# Altium schematic sheet Sheet1.SchDoc
size A; SheetNumber: 1; SheetTotal: 1
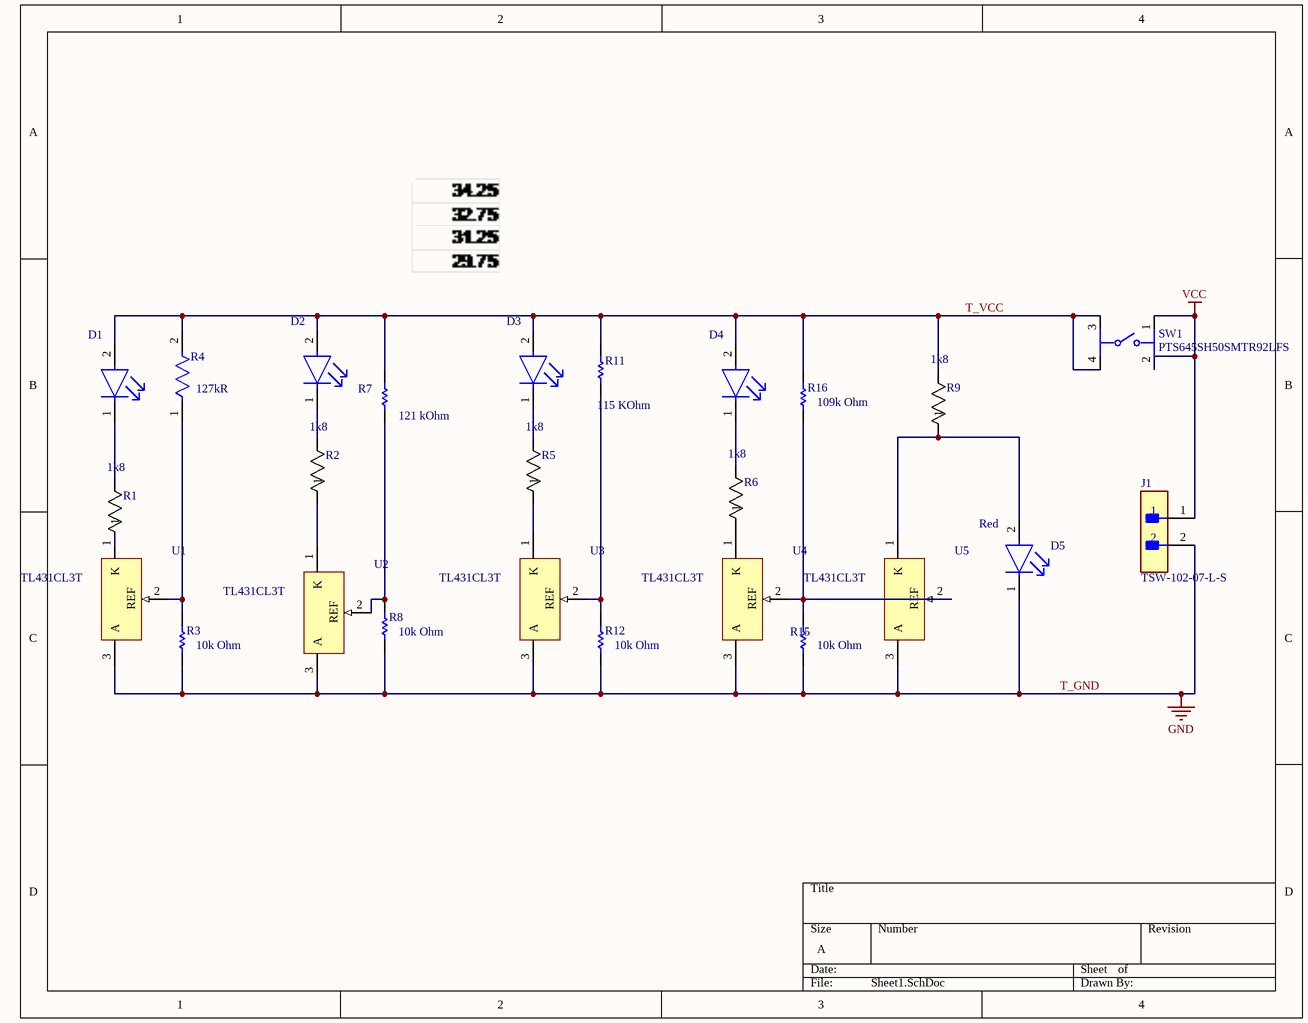
[diagram p0: Sheet1.SchDoc]

## Parts
D1  LTST-C193KGKT-5A  [FP-LTST-C193KGKT-5A-MFG]  (value not drawn)
D2  LTST-C193KGKT-5A  [FP-LTST-C193KGKT-5A-MFG]  (value not drawn)
D3  LTST-C193KGKT-5A  [FP-LTST-C193KGKT-5A-MFG]  (value not drawn)
D4  LTST-C193KGKT-5A  [FP-LTST-C193KGKT-5A-MFG]  (value not drawn)
D5  Illumination Color: Red  [FP-LTST-C193KRKT-5A-MFG]  (hidden comment: LTST-C193KRKT-5A)
J1  TSW-102-07-L-S  [FP-TSW-102-07-L-S-MFG]
R1  Resistance: 1k8  [RES_RMCF2512_STP]  (hidden comment: RMCF2512JT1K80)
R2  Resistance: 1k8  [RES_RMCF2512_STP]  (hidden comment: RMCF2512JT1K80)
R3  value 10k Ohm  [RESC1609X50X30NL8T20]  (hidden comment: CRCW060310K0FKEA)
R4  Resistance: 127kR  [FP-CRCW0603-e3-IPC_A]  (hidden comment: CRCW0603127KFKEA)
R5  Resistance: 1k8  [RES_RMCF2512_STP]  (hidden comment: RMCF2512JT1K80)
R6  Resistance: 1k8  [RES_RMCF2512_STP]  (hidden comment: RMCF2512JT1K80)
R7  value 121 kOhm  [RESC1608X55X25ML10T15]  (hidden comment: RC0603FR-07121KL)
R8  value 10k Ohm  [RESC1609X50X30NL8T20]  (hidden comment: CRCW060310K0FKEA)
R9  Resistance: 1k8  [RES_RMCF2512_STP]  (hidden comment: RMCF2512JT1K80)
R11  value 115 KOhm  [RESC1608X55X30ML15T15]  (hidden comment: ERJ-3EKF1153V)
R12  value 10k Ohm  [RESC1609X50X30NL8T20]  (hidden comment: CRCW060310K0FKEA)
R15  value 10k Ohm  [RESC1609X50X30NL8T20]  (hidden comment: CRCW060310K0FKEA)
R16  value 109k Ohm  [RESC2013X60X35NL10T20]  (hidden comment: RC0805FR-109K09L)
SW1  PTS645SH50SMTR92LFS  [FP-PTS645SH50SMTR92LFS-MFG]
U1  TL431CL3T  [SOT23-3_M]
U2  TL431CL3T  [SOT23-3_M]
U3  TL431CL3T  [SOT23-3_M]
U4  TL431CL3T  [SOT23-3_M]
U5  TL431CL3T  [SOT23-3_M]

## Nets
T_GND: D5.1(C) J1.2 R3.1 R8.1 R12.1 R15.1 U1.3(A) U2.3(A) U3.3(A) U4.3(A) U5.3(A)  [also labelled GND]
VCC: J1.1 SW1.1 SW1.2
T_VCC: D1.2(A) D2.2(A) D3.2(A) D4.2(A) R4.2 R7.2 R9.2 R11.2 R16.2 SW1.3 SW1.4
NetD1_1: D1.1(C) R1.2
NetD2_1: D2.1(C) R2.2
NetD3_1: D3.1(C) R5.2
NetD4_1: D4.1(C) R6.2
NetD5_2: D5.2(A) R9.1 U5.1(K)
NetR1_1: R1.1 U1.1(K)
NetR2_1: R2.1 U2.1(K)
NetR3_2: R3.2 R4.1 U1.2(REF)
NetR5_1: R5.1 U3.1(K)
NetR6_1: R6.1 U4.1(K)
NetR7_1: R7.1 R8.2 U2.2(REF)
NetR11_1: R11.1 R12.2 U3.2(REF)
NetR15_2: R15.2 R16.1 U4.2(REF) U5.2(REF)

## Library data of the parts
D1-D4 = CMP-2000-06622-2: LED GREEN CLEAR CHIP SMD; Forward Current: 30mA; Power Dissipation: 75mW; Luminous Intensity: 28mcd; Lens Style: Diffused; Lens Color: Colorless; Forward Voltage: 2.3V; Test Current: 5mA; Viewing Angle: 130°; Reverse Voltage: 5V; Dominant Wavelength: 576.5nm; Number of Elements: 1; Number of Pins: 2; Case/Package: 0603; Width: 0.8mm; Radiation Hardening: No; Lead Free: Lead Free; Lens Transparency: Clear; Max Operating Temperature: 85°C; Illumination Color: Green; Color: Green; Packaging: Tape and Reel; Depth: 0.8mm; Length: 1.6mm; Mount: Surface Mount; Case Code (Imperial): 0603; Height: 0.35mm; Min Operating Temperature: -55°C; Package Quantity: 3000; Case Code (Metric): 1608; Power Rating: 75mW; Number of LEDs: 1
D5 = CMP-2000-06623-2: LED RED CLEAR CHIP SMD; Power Dissipation: 50mW; Lens Style: Diffused; Test Current: 5mA; Dominant Wavelength: 631nm; Reverse Voltage: 5V; Number of Elements: 1; Viewing Angle: 130°; Luminous Intensity: 45mcd; Lens Color: Colorless; Forward Voltage: 2.3V; Case Code (Imperial): 0603; Lead Free: Lead Free; Radiation Hardening: No; Width: 0.8mm; Number of Pins: 2; Packaging: Tape and Reel; Depth: 0.8mm; Height: 0.35mm; Mount: Surface Mount; Case Code (Metric): 1608; Forward Current: 5mA; Lens Transparency: Clear; Case/Package: 0603; Length: 1.6mm; Color: Red; Max Operating Temperature: 85°C; Number of LEDs: 1; Min Operating Temperature: -55°C; Package Quantity: 3000
J1 = CMP-02766-001428-1: CONN HEADER VERT 2POS 2.54MM; Voltage Rating: 550V; Current Rating: 7.6A; Gender: Male; Number of Contacts: 2; Connector Type: Male Pin; Radiation Hardening: No; Orientation: Straight; Contact Plating: Gold; Max Operating Temperature: 125°C; Mount: Through Hole; Package Quantity: 1; Number of Rows: 1; Housing Material: Polyester; RoHS Compliant: Yes; Length: 5.08mm; Max Voltage Rating (AC): 550V; Pitch: 2.54mm; Packaging: Bulk; Depth: 2.54mm; Termination: Solder; Min Operating Temperature: -55°C; Housing Color: Black; Lead Free: Lead Free; Color: Black; Number of Positions: 2; Width: 2.54mm; Max Current Rating: 7.6A; REACH SVHC: No SVHC; Contact Material: Bronze; Contact Mating Length: 0.23inch; Series: TSW; Contact Type: Male Pin
R1 R2 R5 R6 R9 = RMCF2512JT1K80: No Description Available; Mfr_Name: Stackpole International; Rate: 1W
R3 R8 R12 R15 = CMP-1666-00005-4: Chip Resistor, 10 KOhm, +/- 1%, 100 mW, -55 to 155 degC, 0603 (1608 Metric), RoHS, Tape and Reel; Manufacturer: Vishay Semiconductor; Voltage Rating: 75 V; Max Operating Temperature: 155 degC; PackageDescription: 2-Pin Surface Mount Device, Body 1.575 x 0.85 mm; ComponentLink1Description: Manufacturer URL; RoHSCompliant: true; PackageReference: 0603; REACH SVHC: Unknown; Length: 1.55 mm; DatasheetVersion: 06/2012; Packaging: Tape and Reel; Min Operating Temperature: -55 degC; Mounting Technology: Surface Mount; ComponentLink2URL: https://datasheet.ciiva.com/11809/0900766b80d98afc-11809037.pdf; Height: 0.45 mm; ComponentLink2Description: Datasheet; Package Quantity: 5000; ComponentLink1URL: http://www.vishay.com/
R4 = CMP-2000-03875-2: RES Thick Film, 127kΩ, 1%, 0.1W, 100ppm/°C, 0603; Voltage Rating: 75V; Power Rating: 100mW; Max Operating Temperature: 155°C; Height: 0.02inch; Composition: Thick Film; Case/Package: 0603; Number of Terminations: 2; Width: 0.033inch; Contact Plating: Tin; Features: Automotive AEC-Q200; Length: 1.55mm; Package Quantity: 10; Depth: 0.85mm; Working Voltage: 75V; Termination: SMD/SMT; Number of Pins: 2; Case Code (Metric): 1608; Radiation Hardening: No; Temperature Coefficient: 100ppm/°C; Weight: 7.1E-05oz; Min Operating Temperature: -55°C; Max Power Dissipation: 100mW; Tolerance: 1%; Military Standard: Not; Case Code (Imperial): 0603; Voltage Rating (DC): 75V; Lead Free: Lead Free; Packaging: Tape and Reel
R7 = CMP-2000-04893-1: Manufacturer: Yageo; Part Number: RC0603FR-07121KL
R11 = CMP-2000-00208-1: Manufacturer: Panasonic; Part Number: ERJ-3EKF1153V
R16 = CMP-2001-01325-1: Manufacturer: Yageo; Part Number: RC0805FR-109K09L
SW1 = CMP-10040-000028-1: SWITCH TACTILE SPST-NO 0.05A 12V; Operating Force: 200gf; Current Rating: 50mA; Illumination Type: Non-Illuminated; Actuator Material: Nylon; Throw Configuration: SPST; Switch Function: Off-Mom; Mechanical Life: 100000Cycles; Actuator Type: Standard; Packaging: Tape and Reel; Termination: Gull Wing; Max Operating Temperature: 60°C; Length: 6mm; REACH SVHC: No SVHC; Orientation: Straight; Max Voltage Rating (DC): 12V; Package Quantity: 1000; Max Current Rating: 50mA; Mount: Surface Mount; Contact Material: Bronze; Case/Package: SMD/SMT; Lead Free: Lead Free; Min Operating Temperature: -20°C; Contact Plating: Silver; Color: Black; Depth: 9mm; Voltage Rating (DC): 12V
U1-U5 = CMP-0242-00063-1: Programmable Voltage Reference, 2.5 to 36V, 3-Pin SOT23-3, Tape and Reel; PackageVersion: 2011; PackageDescription: 3-Pin SOT-23 Package 0.95 mm Pitch, 2.4 mm Lead Span; PackageReference: SOT23-3; DatasheetVersion: Oct-2011; ComponentLink2Description: Datasheet; ComponentLink2URL: http://www.st.com/internet/com/TECHNICAL_RESOURCES/TECHNICAL_LITERATURE/DATASHEET/CD00000986.pdf; ComponentLink1Description: Manufacturer URL; ComponentLink1URL: http://www.st.com